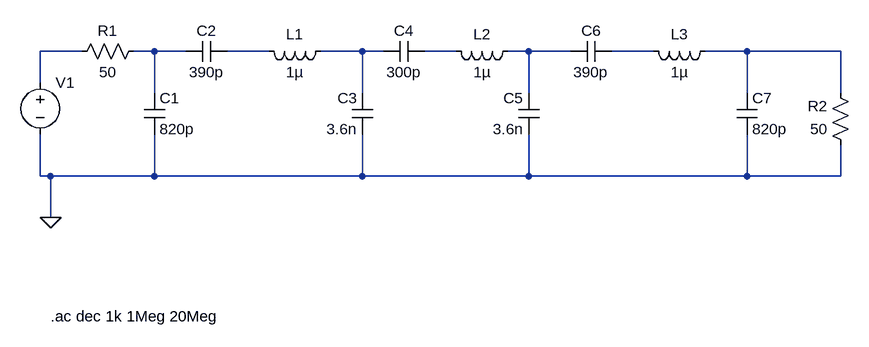
[diagram p0: schematic design2.asc]
design2.asc, the LTspice schematic file:
Version 4
SHEET 1 2244 680
WIRE 160 192 96 192
WIRE 272 192 240 192
WIRE 320 192 272 192
WIRE 448 192 384 192
WIRE 592 192 528 192
WIRE 624 192 592 192
WIRE 736 192 688 192
WIRE 848 192 816 192
WIRE 912 192 848 192
WIRE 1040 192 976 192
WIRE 1184 192 1120 192
WIRE 1328 192 1184 192
WIRE 96 240 96 192
WIRE 272 256 272 192
WIRE 592 256 592 192
WIRE 848 256 848 192
WIRE 1184 256 1184 192
WIRE 1328 256 1328 192
WIRE 96 384 96 320
WIRE 112 384 96 384
WIRE 272 384 272 320
WIRE 272 384 112 384
WIRE 592 384 592 320
WIRE 592 384 272 384
WIRE 848 384 848 320
WIRE 848 384 592 384
WIRE 1184 384 1184 320
WIRE 1184 384 848 384
WIRE 1328 384 1328 336
WIRE 1328 384 1184 384
WIRE 112 448 112 384
FLAG 112 448 0
SYMBOL voltage 96 224 R0
SYMATTR InstName V1
SYMATTR Value ""
SYMATTR Value2 AC 2
SYMBOL res 256 176 R90
WINDOW 0 0 56 VBottom 2
WINDOW 3 32 56 VTop 2
SYMATTR InstName R1
SYMATTR Value 50
SYMBOL res 1344 352 R180
WINDOW 0 36 76 Left 2
WINDOW 3 36 40 Left 2
SYMATTR InstName R2
SYMATTR Value 50
SYMBOL cap 256 256 R0
SYMATTR InstName C1
SYMATTR Value 820p
SYMBOL cap 384 176 R90
WINDOW 0 0 32 VBottom 2
WINDOW 3 32 32 VTop 2
SYMATTR InstName C2
SYMATTR Value 390p
SYMBOL cap 608 320 R180
WINDOW 0 24 56 Left 2
WINDOW 3 24 8 Left 2
SYMATTR InstName C3
SYMATTR Value 3.6n
SYMBOL cap 688 176 R90
WINDOW 0 0 32 VBottom 2
WINDOW 3 32 32 VTop 2
SYMATTR InstName C4
SYMATTR Value 300p
SYMBOL cap 864 320 R180
WINDOW 0 24 56 Left 2
WINDOW 3 24 8 Left 2
SYMATTR InstName C5
SYMATTR Value 3.6n
SYMBOL cap 912 208 R270
WINDOW 0 32 32 VTop 2
WINDOW 3 0 32 VBottom 2
SYMATTR InstName C6
SYMATTR Value 390p
SYMBOL cap 1168 256 R0
SYMATTR InstName C7
SYMATTR Value 820p
SYMBOL ind 544 176 R90
WINDOW 0 5 56 VBottom 2
WINDOW 3 32 56 VTop 2
SYMATTR InstName L1
SYMATTR Value 1µ
SYMATTR SpiceLine Rser=1.25
SYMBOL ind 832 176 R90
WINDOW 0 5 56 VBottom 2
WINDOW 3 32 56 VTop 2
SYMATTR InstName L2
SYMATTR Value 1µ
SYMATTR SpiceLine Rser=1.25
SYMBOL ind 1136 176 R90
WINDOW 0 5 56 VBottom 2
WINDOW 3 32 56 VTop 2
SYMATTR InstName L3
SYMATTR Value 1µ
SYMATTR SpiceLine Rser=1.25
TEXT 112 600 Left 2 !.ac dec 1k 1Meg 20Meg

The netlist it stands for:
* design2.asc
V1 N001 0 AC 2
R1 N002 N001 50
R2 0 N008 50
C1 N002 0 820p
C2 N003 N002 390p
C3 0 N004 3.6n
C4 N005 N004 300p
C5 0 N006 3.6n
C6 N006 N007 390p
C7 N008 0 820p
L1 N004 N003 1µ Rser=1.25
L2 N006 N005 1µ Rser=1.25
L3 N008 N007 1µ Rser=1.25
.ac dec 1k 1Meg 20Meg
.backanno
.end